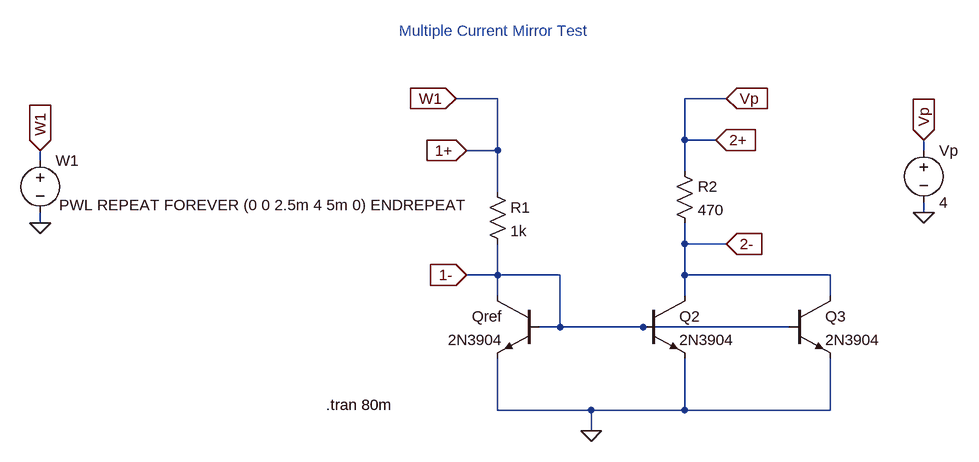
[diagram p0: schematic multi_current_mirror.asc]
multi_current_mirror.asc, the LTspice schematic file:
Version 4
SHEET 1 2112 1044
WIRE -272 -96 -336 -96
WIRE 80 -96 16 -96
WIRE 16 -32 16 -96
WIRE 64 -32 16 -32
WIRE -272 -16 -272 -96
WIRE -272 -16 -320 -16
WIRE 384 -16 384 -32
WIRE -976 0 -976 -16
WIRE 16 16 16 -32
WIRE -272 48 -272 -16
WIRE 384 80 384 64
WIRE -976 96 -976 80
WIRE 16 128 16 96
WIRE 80 128 16 128
WIRE -272 176 -272 128
WIRE -272 176 -320 176
WIRE -176 176 -272 176
WIRE 16 176 16 128
WIRE 240 176 16 176
WIRE -272 208 -272 176
WIRE 16 208 16 176
WIRE 240 208 240 176
WIRE -176 256 -176 176
WIRE -176 256 -208 256
WIRE -48 256 -176 256
WIRE 176 256 -48 256
WIRE -272 384 -272 304
WIRE -128 384 -272 384
WIRE 16 384 16 304
WIRE 16 384 -128 384
WIRE 240 384 240 304
WIRE 240 384 16 384
WIRE -128 416 -128 384
FLAG -976 96 0
FLAG -976 -16 W1
IOPIN -976 -16 In
FLAG -128 416 0
FLAG -336 -96 W1
IOPIN -336 -96 In
FLAG 80 -96 Vp
IOPIN 80 -96 In
FLAG -320 -16 1+
IOPIN -320 -16 In
FLAG -320 176 1-
IOPIN -320 176 In
FLAG 64 -32 2+
IOPIN 64 -32 In
FLAG 384 80 0
FLAG 384 -32 Vp
IOPIN 384 -32 In
FLAG 80 128 2-
IOPIN 80 128 In
SYMBOL voltage -976 -16 R0
WINDOW 3 29 84 Left 2
WINDOW 123 0 0 Left 0
WINDOW 39 0 0 Left 0
SYMATTR Value PWL REPEAT FOREVER (0 0 2.5m 4 5m 0) ENDREPEAT
SYMATTR InstName W1
SYMBOL res -288 32 R0
SYMATTR InstName R1
SYMATTR Value 1k
SYMBOL res 0 0 R0
SYMATTR InstName R2
SYMATTR Value 470
SYMBOL npn -208 208 M0
SYMATTR InstName Qref
SYMATTR Value 2N3904
SYMBOL npn -48 208 R0
SYMATTR InstName Q2
SYMATTR Value 2N3904
SYMBOL voltage 384 -32 R0
SYMATTR InstName Vp
SYMATTR Value 4
SYMBOL npn 176 208 R0
SYMATTR InstName Q3
SYMATTR Value 2N3904
TEXT -424 -200 Left 2 ;Multiple Current Mirror Test
TEXT -536 376 Left 2 !.tran 80m

The netlist it stands for:
* multi_current_mirror.asc
V§W1 1+ 0 PWL REPEAT FOREVER (0 0 2.5m 4 5m 0) ENDREPEAT
R1 1+ 1- 1k
R2 2+ 2- 470
Qref 1- 1- 0 0 2N3904
Q2 2- 1- 0 0 2N3904
Vp 2+ 0 4
Q3 2- 1- 0 0 2N3904
.model NPN NPN
.model PNP PNP
.lib standard.bjt
* Multiple Current Mirror Test
.tran 80m
.backanno
.end